# Altium schematic sheet SMA.SchDoc
size A4; SheetNumber: 1; SheetTotal: 2
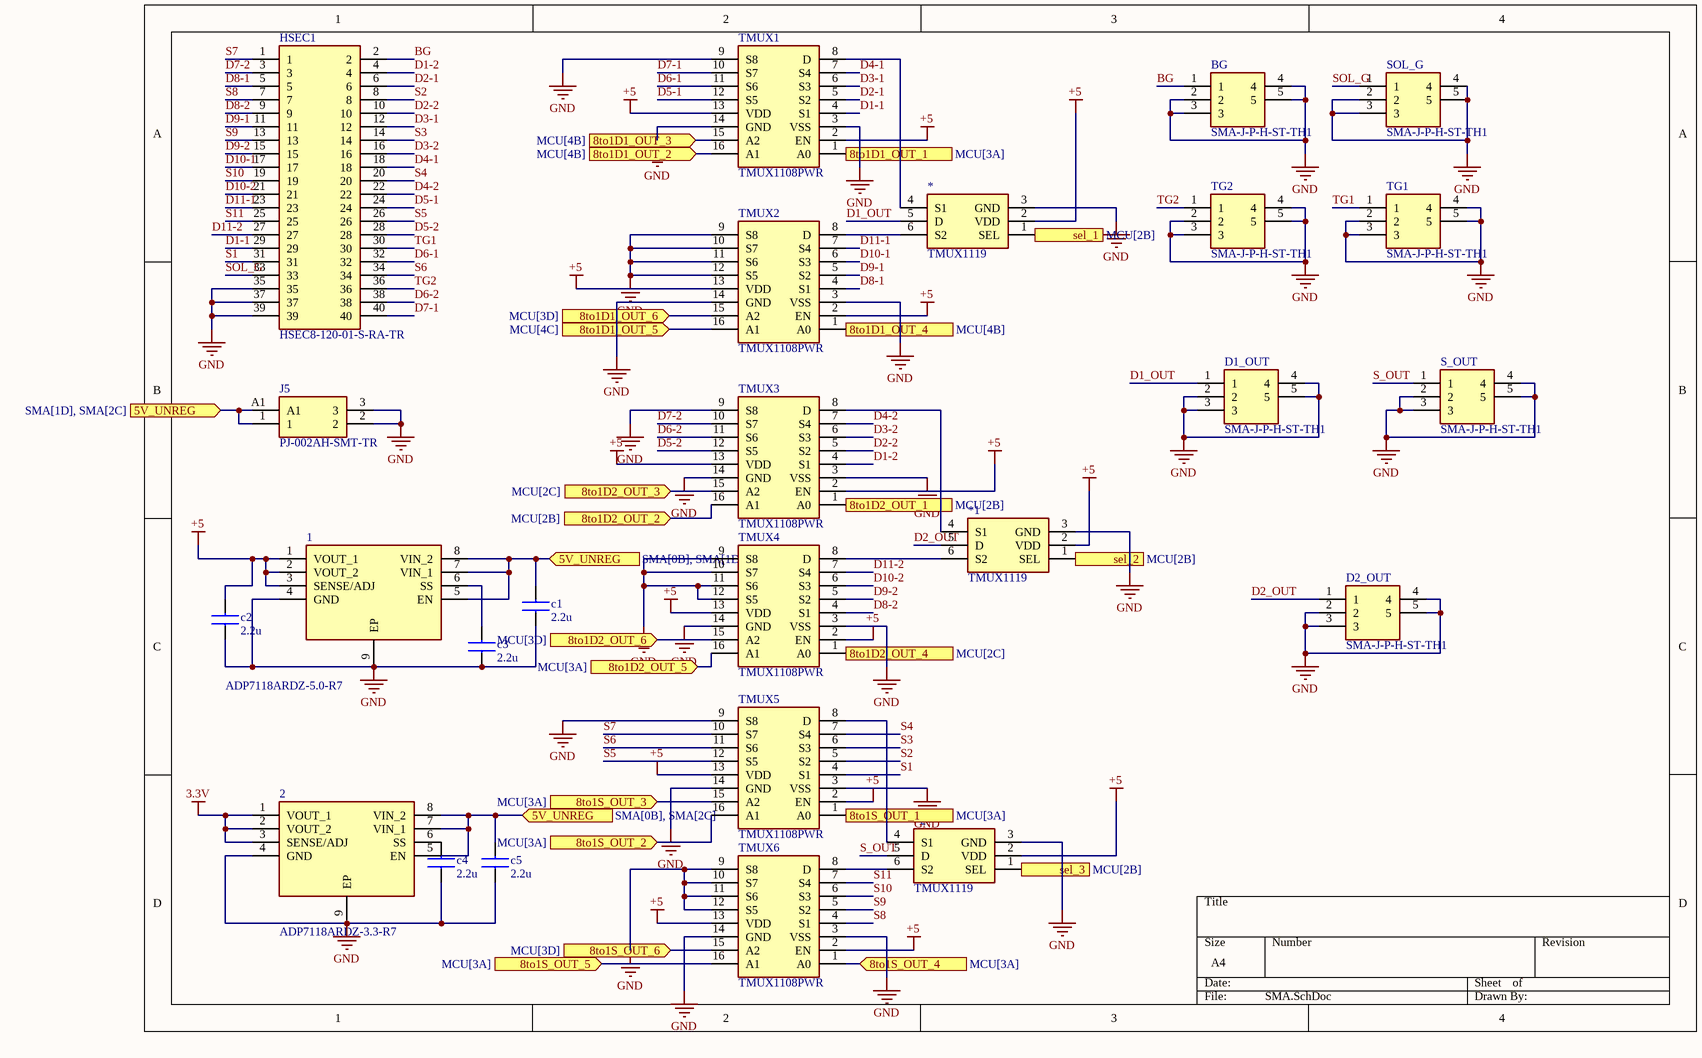
[diagram p0: SMA.SchDoc]

## Parts
1  ADP7118ARDZ-5.0-R7  [ADP7118ARDZ-5.0-R7]
2  ADP7118ARDZ-3.3-R7  [ADP7118ARDZ-5.0-R7]
*  TMUX1119  [TMUX1119DBVR]
*1  TMUX1119  [TMUX1119DBVR]
*2  TMUX1119  [TMUX1119DBVR]
BG  SMA-J-P-H-ST-TH1  [SMAJPHSTTH1]
c1  2.2u  [0805X7R106KT1AT]
c2  2.2u  [0805X7R106KT1AT]
c3  2.2u  [0805X7R106KT1AT]
c4  2.2u  [0805X7R106KT1AT]
c5  2.2u  [0805X7R106KT1AT]
D1_OUT  SMA-J-P-H-ST-TH1  [SMAJPHSTTH1]
D2_OUT  SMA-J-P-H-ST-TH1  [SMAJPHSTTH1]
HSEC1  HSEC8-120-01-S-RA-TR  [SAMTEC_HSEC8-120-01-L-RA]
J5  PJ-002AH-SMT-TR  [PWRPJ]
S_OUT  SMA-J-P-H-ST-TH1  [SMAJPHSTTH1]
SOL_G  SMA-J-P-H-ST-TH1  [SMAJPHSTTH1]
TG1  SMA-J-P-H-ST-TH1  [SMAJPHSTTH1]
TG2  SMA-J-P-H-ST-TH1  [SMAJPHSTTH1]
TMUX1  TMUX1108PWR  [TMUX1108PWR]
TMUX2  TMUX1108PWR  [TMUX1108PWR]
TMUX3  TMUX1108PWR  [TMUX1108PWR]
TMUX4  TMUX1108PWR  [TMUX1108PWR]
TMUX5  TMUX1108PWR  [TMUX1108PWR]
TMUX6  TMUX1108PWR  [TMUX1108PWR]

## Ports
5V_UNREG (in, see SMA[0B], SMA[1D]), 5V_UNREG (in, see SMA[0B], SMA[2C]), 5V_UNREG (in, see SMA[1D], SMA[2C]), 8to1D1_OUT_1 (in, see MCU[3A]), 8to1D1_OUT_2 (in, see MCU[4B]), 8to1D1_OUT_3 (in, see MCU[4B]), 8to1D1_OUT_4 (in, see MCU[4B]), 8to1D1_OUT_5 (in, see MCU[4C]), 8to1D1_OUT_6 (in, see MCU[3D]), 8to1D2_OUT_1 (in, see MCU[2B]), 8to1D2_OUT_2 (in, see MCU[2B]), 8to1D2_OUT_3 (in, see MCU[2C]), 8to1D2_OUT_4 (in, see MCU[2C]), 8to1D2_OUT_5 (in, see MCU[3A]), 8to1D2_OUT_6 (in, see MCU[3D]), 8to1S_OUT_1 (in, see MCU[3A]), 8to1S_OUT_2 (in, see MCU[3A]), 8to1S_OUT_3 (in, see MCU[3A]), 8to1S_OUT_4 (in, see MCU[3A]), 8to1S_OUT_5 (in, see MCU[3A]), 8to1S_OUT_6 (in, see MCU[3D]), sel_1 (in, see MCU[2B]), sel_2 (in, see MCU[2B]), sel_3 (in, see MCU[2B])

## Nets
3.3V: 2.1(VOUT_1) 2.2(VOUT_2) 2.3(SENSE/ADJ)
+5: 1.1(VOUT_1) 1.2(VOUT_2) 1.3(SENSE/ADJ) *.2(VDD) *1.2(VDD) *2.2(VDD) c2.2 TMUX1.2(EN) TMUX1.13(VDD) TMUX2.2(EN) TMUX2.13(VDD) TMUX3.2(EN) TMUX3.13(VDD) TMUX4.2(EN) TMUX4.13(VDD) TMUX5.2(EN) TMUX5.13(VDD) TMUX6.2(EN) TMUX6.13(VDD)
GND: 1.4(GND) 1.9(EP) 2.4(GND) 2.9(EP) *.3(GND) *1.3(GND) *2.3(GND) BG.2 BG.3 BG.4 BG.5 c1.1 c2.1 c3.1 c4.1 c5.1 D1_OUT.2 D1_OUT.3 D1_OUT.4 D1_OUT.5 D2_OUT.2 D2_OUT.3 D2_OUT.4 D2_OUT.5 HSEC1.35 HSEC1.37 HSEC1.39 J5.2 J5.3 S_OUT.2 S_OUT.3 S_OUT.4 S_OUT.5 SOL_G.2 SOL_G.3 SOL_G.4 SOL_G.5 TG1.2 TG1.3 TG1.4 TG1.5 TG2.2 TG2.3 TG2.4 TG2.5 TMUX1.3(VSS) TMUX1.9(S8) TMUX1.14(GND) TMUX2.3(VSS) TMUX2.9(S8) TMUX2.10(S7) TMUX2.11(S6) TMUX2.12(S5) TMUX2.14(GND) TMUX3.3(VSS) TMUX3.9(S8) TMUX3.14(GND) TMUX4.3(VSS) TMUX4.9(S8) TMUX4.10(S7) TMUX4.11(S6) TMUX4.12(S5) TMUX4.14(GND) TMUX5.3(VSS) TMUX5.9(S8) TMUX5.14(GND) TMUX6.3(VSS) TMUX6.9(S8) TMUX6.10(S7) TMUX6.11(S6) TMUX6.12(S5) TMUX6.14(GND)
5V_UNREG: 1.5(EN) 1.7(VIN_1) 1.8(VIN_2) 2.5(EN) 2.7(VIN_1) 2.8(VIN_2) c1.2 c5.2 J5.1 J5.A1 ; port 5V_UNREG
8to1D1_OUT_1: TMUX1.1(A0) ; port 8to1D1_OUT_1
8to1D1_OUT_2: TMUX1.16(A1) ; port 8to1D1_OUT_2
8to1D1_OUT_3: TMUX1.15(A2) ; port 8to1D1_OUT_3
8to1D1_OUT_4: TMUX2.1(A0) ; port 8to1D1_OUT_4
8to1D1_OUT_5: TMUX2.16(A1) ; port 8to1D1_OUT_5
8to1D1_OUT_6: TMUX2.15(A2) ; port 8to1D1_OUT_6
8to1D2_OUT_1: TMUX3.1(A0) ; port 8to1D2_OUT_1
8to1D2_OUT_2: TMUX3.16(A1) ; port 8to1D2_OUT_2
8to1D2_OUT_3: TMUX3.15(A2) ; port 8to1D2_OUT_3
8to1D2_OUT_4: TMUX4.1(A0) ; port 8to1D2_OUT_4
8to1D2_OUT_5: TMUX4.16(A1) ; port 8to1D2_OUT_5
8to1D2_OUT_6: TMUX4.15(A2) ; port 8to1D2_OUT_6
8to1S_OUT_1: TMUX5.1(A0) ; port 8to1S_OUT_1
8to1S_OUT_2: TMUX5.16(A1) ; port 8to1S_OUT_2
8to1S_OUT_3: TMUX5.15(A2) ; port 8to1S_OUT_3
8to1S_OUT_4: TMUX6.1(A0) ; port 8to1S_OUT_4
8to1S_OUT_5: TMUX6.16(A1) ; port 8to1S_OUT_5
8to1S_OUT_6: TMUX6.15(A2) ; port 8to1S_OUT_6
BG: BG.1 HSEC1.2
D1-1: HSEC1.29 TMUX1.4(S1)
D1-2: HSEC1.4 TMUX3.4(S1)
D1_OUT: *.5(D) D1_OUT.1
D2-1: HSEC1.6 TMUX1.5(S2)
D2-2: HSEC1.10 TMUX3.5(S2)
D2_OUT: *1.5(D) D2_OUT.1
D3-1: HSEC1.12 TMUX1.6(S3)
D3-2: HSEC1.16 TMUX3.6(S3)
D4-1: HSEC1.18 TMUX1.7(S4)
D4-2: HSEC1.22 TMUX3.7(S4)
D5-1: HSEC1.24 TMUX1.12(S5)
D5-2: HSEC1.28 TMUX3.12(S5)
D6-1: HSEC1.32 TMUX1.11(S6)
D6-2: HSEC1.38 TMUX3.11(S6)
D7-1: HSEC1.40 TMUX1.10(S7)
D7-2: HSEC1.3 TMUX3.10(S7)
D8-1: HSEC1.5 TMUX2.4(S1)
D8-2: HSEC1.9 TMUX4.4(S1)
D9-1: HSEC1.11 TMUX2.5(S2)
D9-2: HSEC1.15 TMUX4.5(S2)
D10-1: HSEC1.17 TMUX2.6(S3)
D10-2: HSEC1.21 TMUX4.6(S3)
D11-1: HSEC1.23 TMUX2.7(S4)
D11-2: HSEC1.27 TMUX4.7(S4)
S1: HSEC1.31 TMUX5.4(S1)
S2: HSEC1.8 TMUX5.5(S2)
S3: HSEC1.14 TMUX5.6(S3)
S4: HSEC1.20 TMUX5.7(S4)
S5: HSEC1.26 TMUX5.12(S5)
S6: HSEC1.34 TMUX5.11(S6)
S7: HSEC1.1 TMUX5.10(S7)
S8: HSEC1.7 TMUX6.4(S1)
S9: HSEC1.13 TMUX6.5(S2)
S10: HSEC1.19 TMUX6.6(S3)
S11: HSEC1.25 TMUX6.7(S4)
S_OUT: *2.5(D) S_OUT.1
sel_1: *.1(SEL) ; port sel_1
sel_2: *1.1(SEL) ; port sel_2
sel_3: *2.1(SEL) ; port sel_3
SOL_G: HSEC1.33 SOL_G.1
TG1: HSEC1.30 TG1.1
TG2: HSEC1.36 TG2.1
Net1_6: 1.6(SS) c3.2
Net2_6: 2.6(SS) c4.2
Net*1_4: *1.4(S1) TMUX3.8(D)
Net*1_6: *1.6(S2) TMUX4.8(D)
Net*2_4: *2.4(S1) TMUX5.8(D)
Net*2_6: *2.6(S2) TMUX6.8(D)
Net*_4: *.4(S1) TMUX1.8(D)
Net*_6: *.6(S2) TMUX2.8(D)

## Library data of the parts
2 = ADP7118ARDZ-5.0-R7
BG D1_OUT D2_OUT S_OUT SOL_G TG1 TG2 = SMA-J-P-H-ST-TH1: SAMTEC - SMA-J-P-H-ST-TH1 - RF COAXIAL, SMA JACK, 50 OHM, PCB; Geometry.Height: 9.55mm; Mouser Part Number: 200-SMAJPHSTTH1; Mouser Price/Stock: https://www.mouser.co.uk/ProductDetail/Samtec/SMA-J-P-H-ST-TH1?qs=bkXRl3BLxbHdaAB2Qwy6zw%3D%3D; Manufacturer_Name: SAMTEC; Manufacturer_Part_Number: SMA-J-P-H-ST-TH1; Datasheet Link: http://suddendocs.samtec.com/prints/sma-j-p-x-st-th1-mkt.pdf
c1-c5 = capacitor
J5 = Powerinput